# Altium project PIC18F57Q84_Curiosity_Nano.PrjPcb
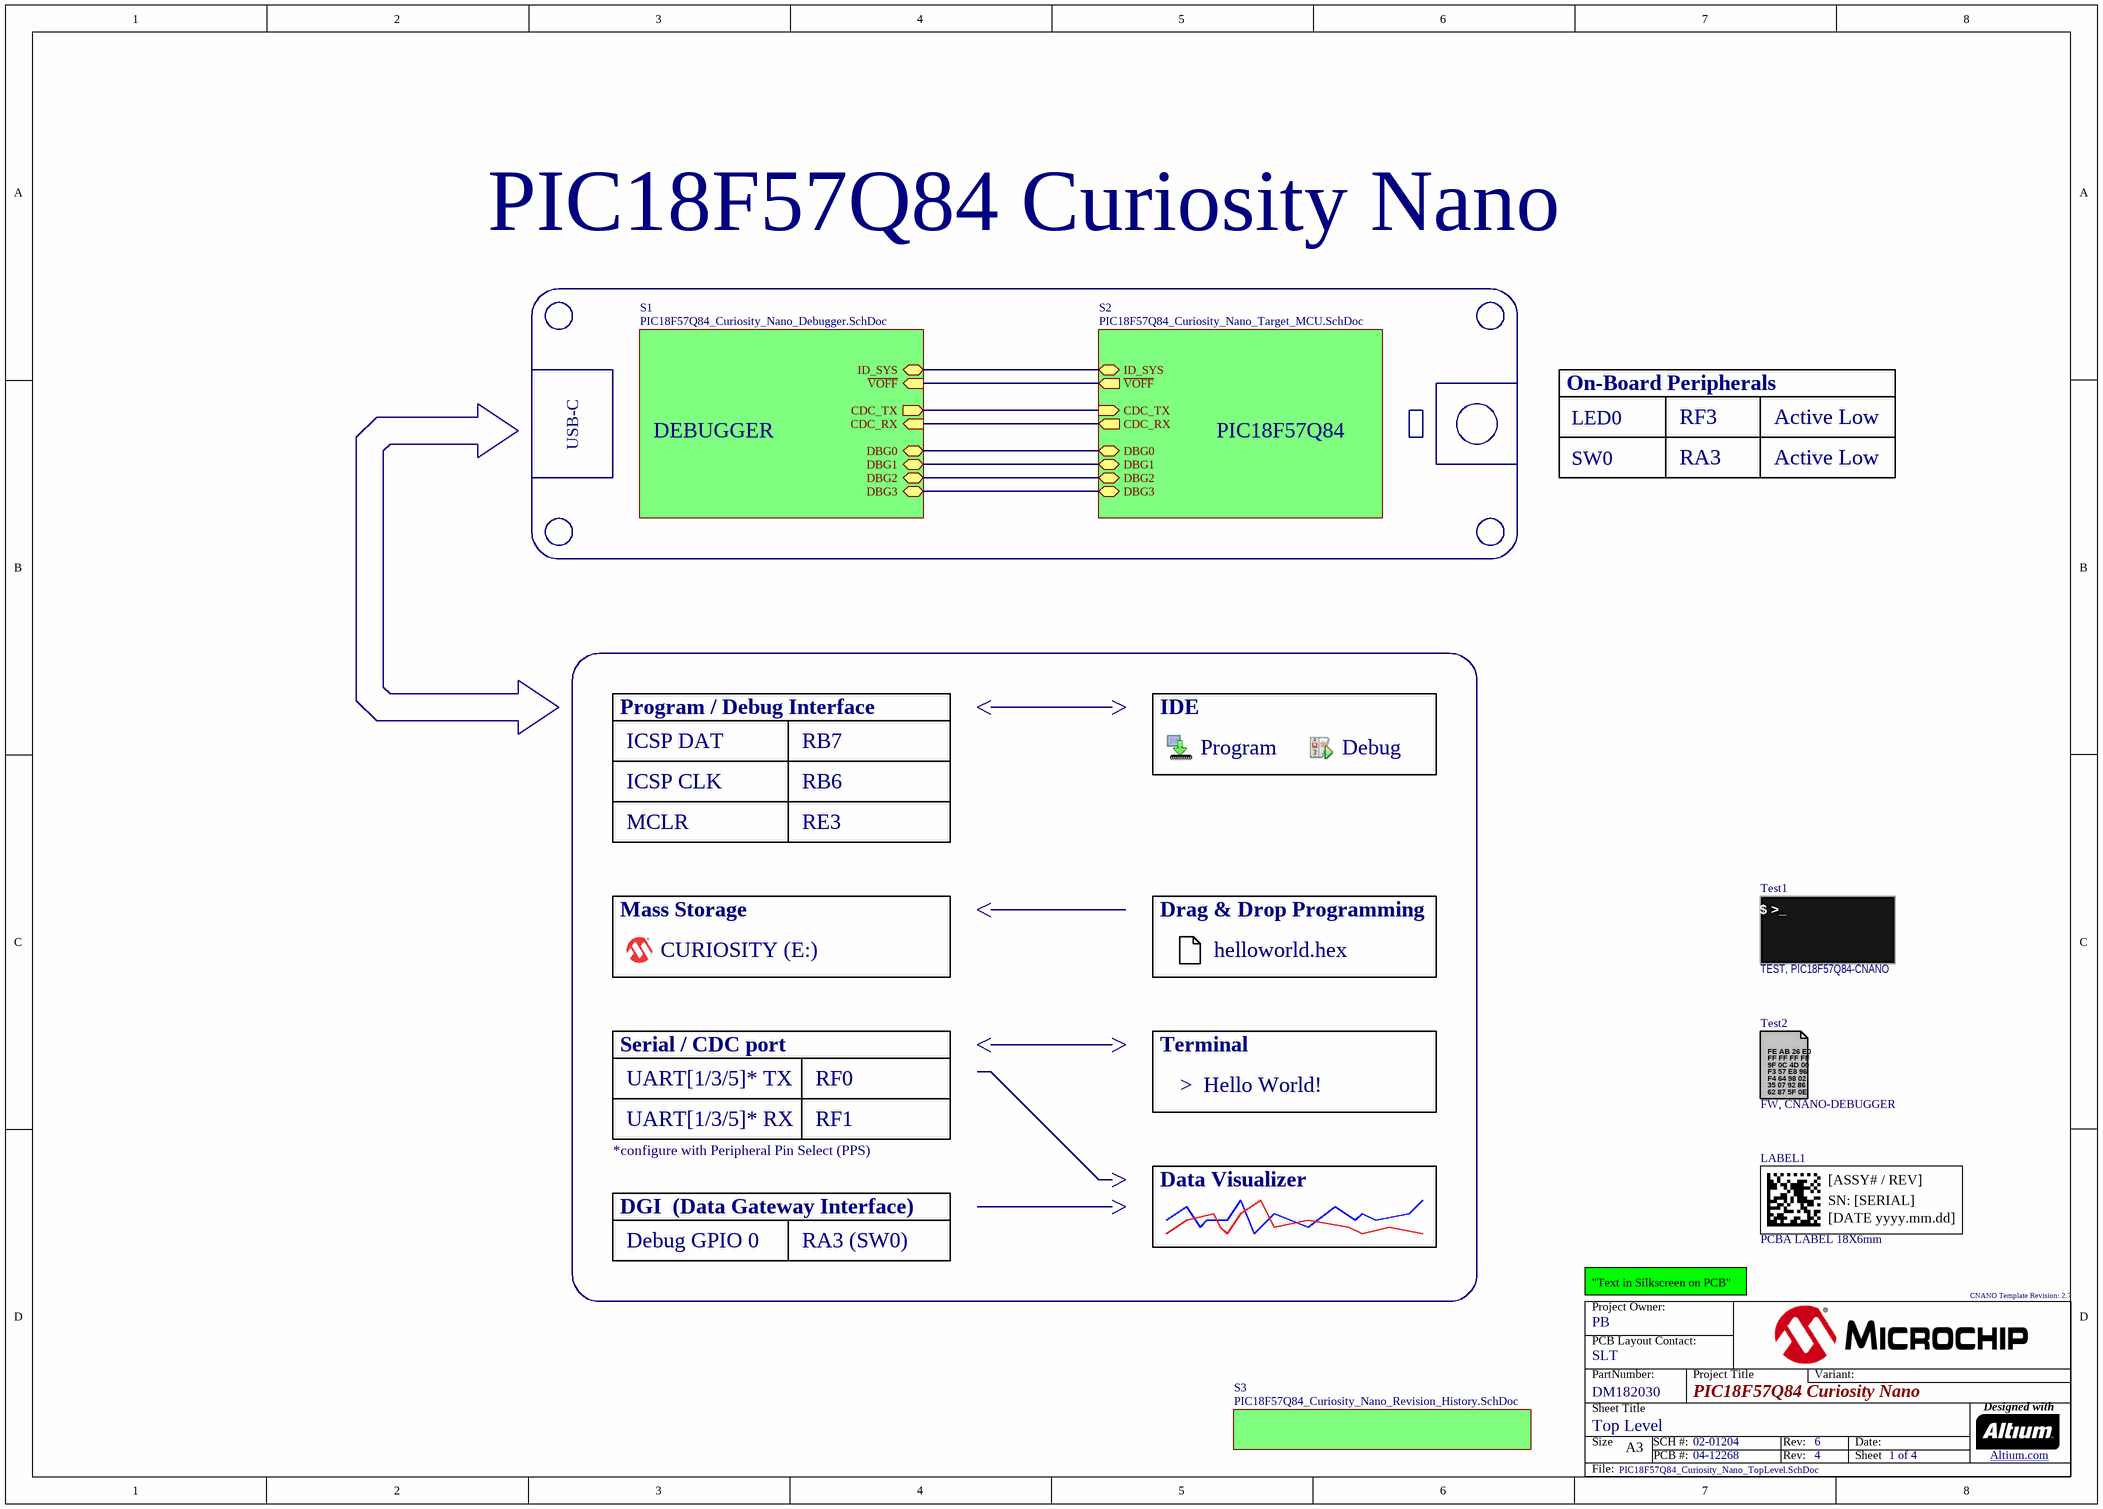
[diagram p0: PIC18F57Q84_Curiosity_Nano_TopLevel.SchDoc]
OutjobTitle: PIC18F57Q84-Curiosity-Nano; ProjectTitle: PIC18F57Q84 Curiosity Nano; ProjectTargetName: PIC18F57Q84; ProjectPCBFabRevision: 4; ProjectPCBFabNumber: 04-12268; ProjectPCBAssyRevision: 6; ProjectPCBAssyNumber: 02-01204; ProjectPartNumber: DM182030; ProjectContactPCB: SLT; ProjectContactOwner: PB; CNANO_Template_Revision: 2.7
4 sheets, 87 parts. Net scope: hierarchical (ports join the sheet entries above them; power ports are global).
Board file: PIC18F57Q84_Curiosity_Nano.PcbDoc
Sheets:
  PIC18F57Q84_Curiosity_Nano_TopLevel.SchDoc
    S2 = PIC18F57Q84_Curiosity_Nano_Target_MCU.SchDoc
    S1 = PIC18F57Q84_Curiosity_Nano_Debugger.SchDoc
    S3 = PIC18F57Q84_Curiosity_Nano_Revision_History.SchDoc

## Sheet PIC18F57Q84_Curiosity_Nano_TopLevel.SchDoc
size A3; SheetTitle: Top Level; CompanyName: Microchip Technology Inc.; Organization: Microchip Technology; Address1: 2355 West Chandler Blvd.; Address2: Chandler, AZ  85224; Address4: USA; SheetNumber: 1; SheetTotal: 4; Time: Time

### Parts
LABEL1  value PCBA LABEL 18X6mm  [08-10015]  (hidden comment: 08-10015)
Test1  Description_: TEST, PIC18F57Q84-CNANO  (hidden comment: Mechanical)  (mechanical)
Test2  Description_: FW, CNANO-DEBUGGER  (hidden comment: Mechanical)  (mechanical)

### Sub-sheets
S1 = PIC18F57Q84_Curiosity_Nano_Debugger.SchDoc: DBG2 (bidir), DBG1 (bidir), DBG3 (bidir), DBG0 (bidir), ~{VOFF} (in), ID_SYS (bidir), CDC_RX (in), CDC_TX (out)
S2 = PIC18F57Q84_Curiosity_Nano_Target_MCU.SchDoc: DBG0 (bidir), DBG1 (bidir), DBG3 (bidir), DBG2 (bidir), ~{VOFF} (out), ID_SYS (bidir), CDC_RX (out), CDC_TX (in)
S3 = PIC18F57Q84_Curiosity_Nano_Revision_History.SchDoc: no entries

### Nets
CDC_RX: sheet S2/CDC_RX, sheet S1/CDC_RX
CDC_TX: sheet S2/CDC_TX, sheet S1/CDC_TX
DBG0: sheet S2/DBG0, sheet S1/DBG0
DBG1: sheet S2/DBG1, sheet S1/DBG1
DBG2: sheet S2/DBG2, sheet S1/DBG2
DBG3: sheet S2/DBG3, sheet S1/DBG3
ID_SYS: sheet S2/ID_SYS, sheet S1/ID_SYS
~{VOFF}: sheet S2/~{VOFF}, sheet S1/~{VOFF}

### Notes on the sheet
- USB-C
- DEBUGGER
- On-Board Peripherals
- LED0
- RF3
- Active Low
- SW0
- RA3
- Program / Debug Interface
- IDE
- ICSP DAT
- RB7
- Program
- Debug
- ICSP CLK
- MCLR
- RB6
- RE3
- Mass Storage
- Drag & Drop Programming
- CURIOSITY (E:)
- helloworld.hex
- Serial / CDC port
- Terminal
- UART[1/3/5]* TX
- UART[1/3/5]* RX
- RF1
- RF0
- >  Hello World!
- *configure with Peripheral Pin Select (PPS)
- Data Visualizer
- DGI  (Data Gateway Interface)
- Debug GPIO 0
- RA3 (SW0)
- "Text in Silkscreen on PCB"
- Project Owner:
- PCB Layout Contact:
- PartNumber:
- Project Title
- Variant:
- Sheet Title
- Size
- A3
- SCH #:
- PCB #:
- Rev:
- Date:
- Sheet
- Designed with
- Altium.com <http://go.altium.com/MicrochipLandingPage_Evaluation.html>
- File:
- (in symbol 08-10015) [ASSY# / REV]; SN: [SERIAL]; [DATE yyyy.mm.dd]
- (in symbol 13-00018) FE AB 26 E0; FF FF FF FF; 9F 0C 4D 00; F3 57 E8 96; F4 64 98 02; 35 07 92 86; 62 87 5F 0E
- (in symbol 13-01146) $ >_

### Library data of the parts
LABEL1 = 08-10015: Manufacturer 1: ACT Logimark AS; Manufacturer Part Number 1: 505462; Description_: LABEL PCBA 18x6mm Datamatrix Assy# / Rev / Serial / Date; Populated: MECH; Revision: 4; Symbol: 08-10015; Category: MCHP-Manufacturing; Type: PCBA Label; Manufacturer 2: Sunrise Paper (M) Sdn Bhd; Manufacturer Part Number 2: 037268-5; Manufacturer 3: Raynen; Manufacturer Part Number 3: 10010407; Supplier 1: ACT Logimark AS; Supplier Part Number 1: 505462; Supplier 2: Microchip Technology; Supplier Part Number 2: 01000-004967; Supplier 3: Raynen; Supplier Part Number 3: 10010407
Test1 = 13-01146: Populated: Yes; Revision: 5; Type: Test Procedure Automated; Category: MCHP-Manufacturing
Test2 = 13-00018: Populated: Yes; Value: Debugger Firmware; Revision: 9; Type: Test Procedure Firmware; Category: MCHP-Manufacturing

## Sheet PIC18F57Q84_Curiosity_Nano_Target_MCU.SchDoc
size A3; SheetTitle: Target MCU; CompanyName: Microchip Technology Inc.; Organization: Microchip Technology; Address1: 2355 West Chandler Blvd.; Address2: Chandler, AZ  85224; Address4: USA; SheetNumber: 2; SheetTotal: 4; Time: Time
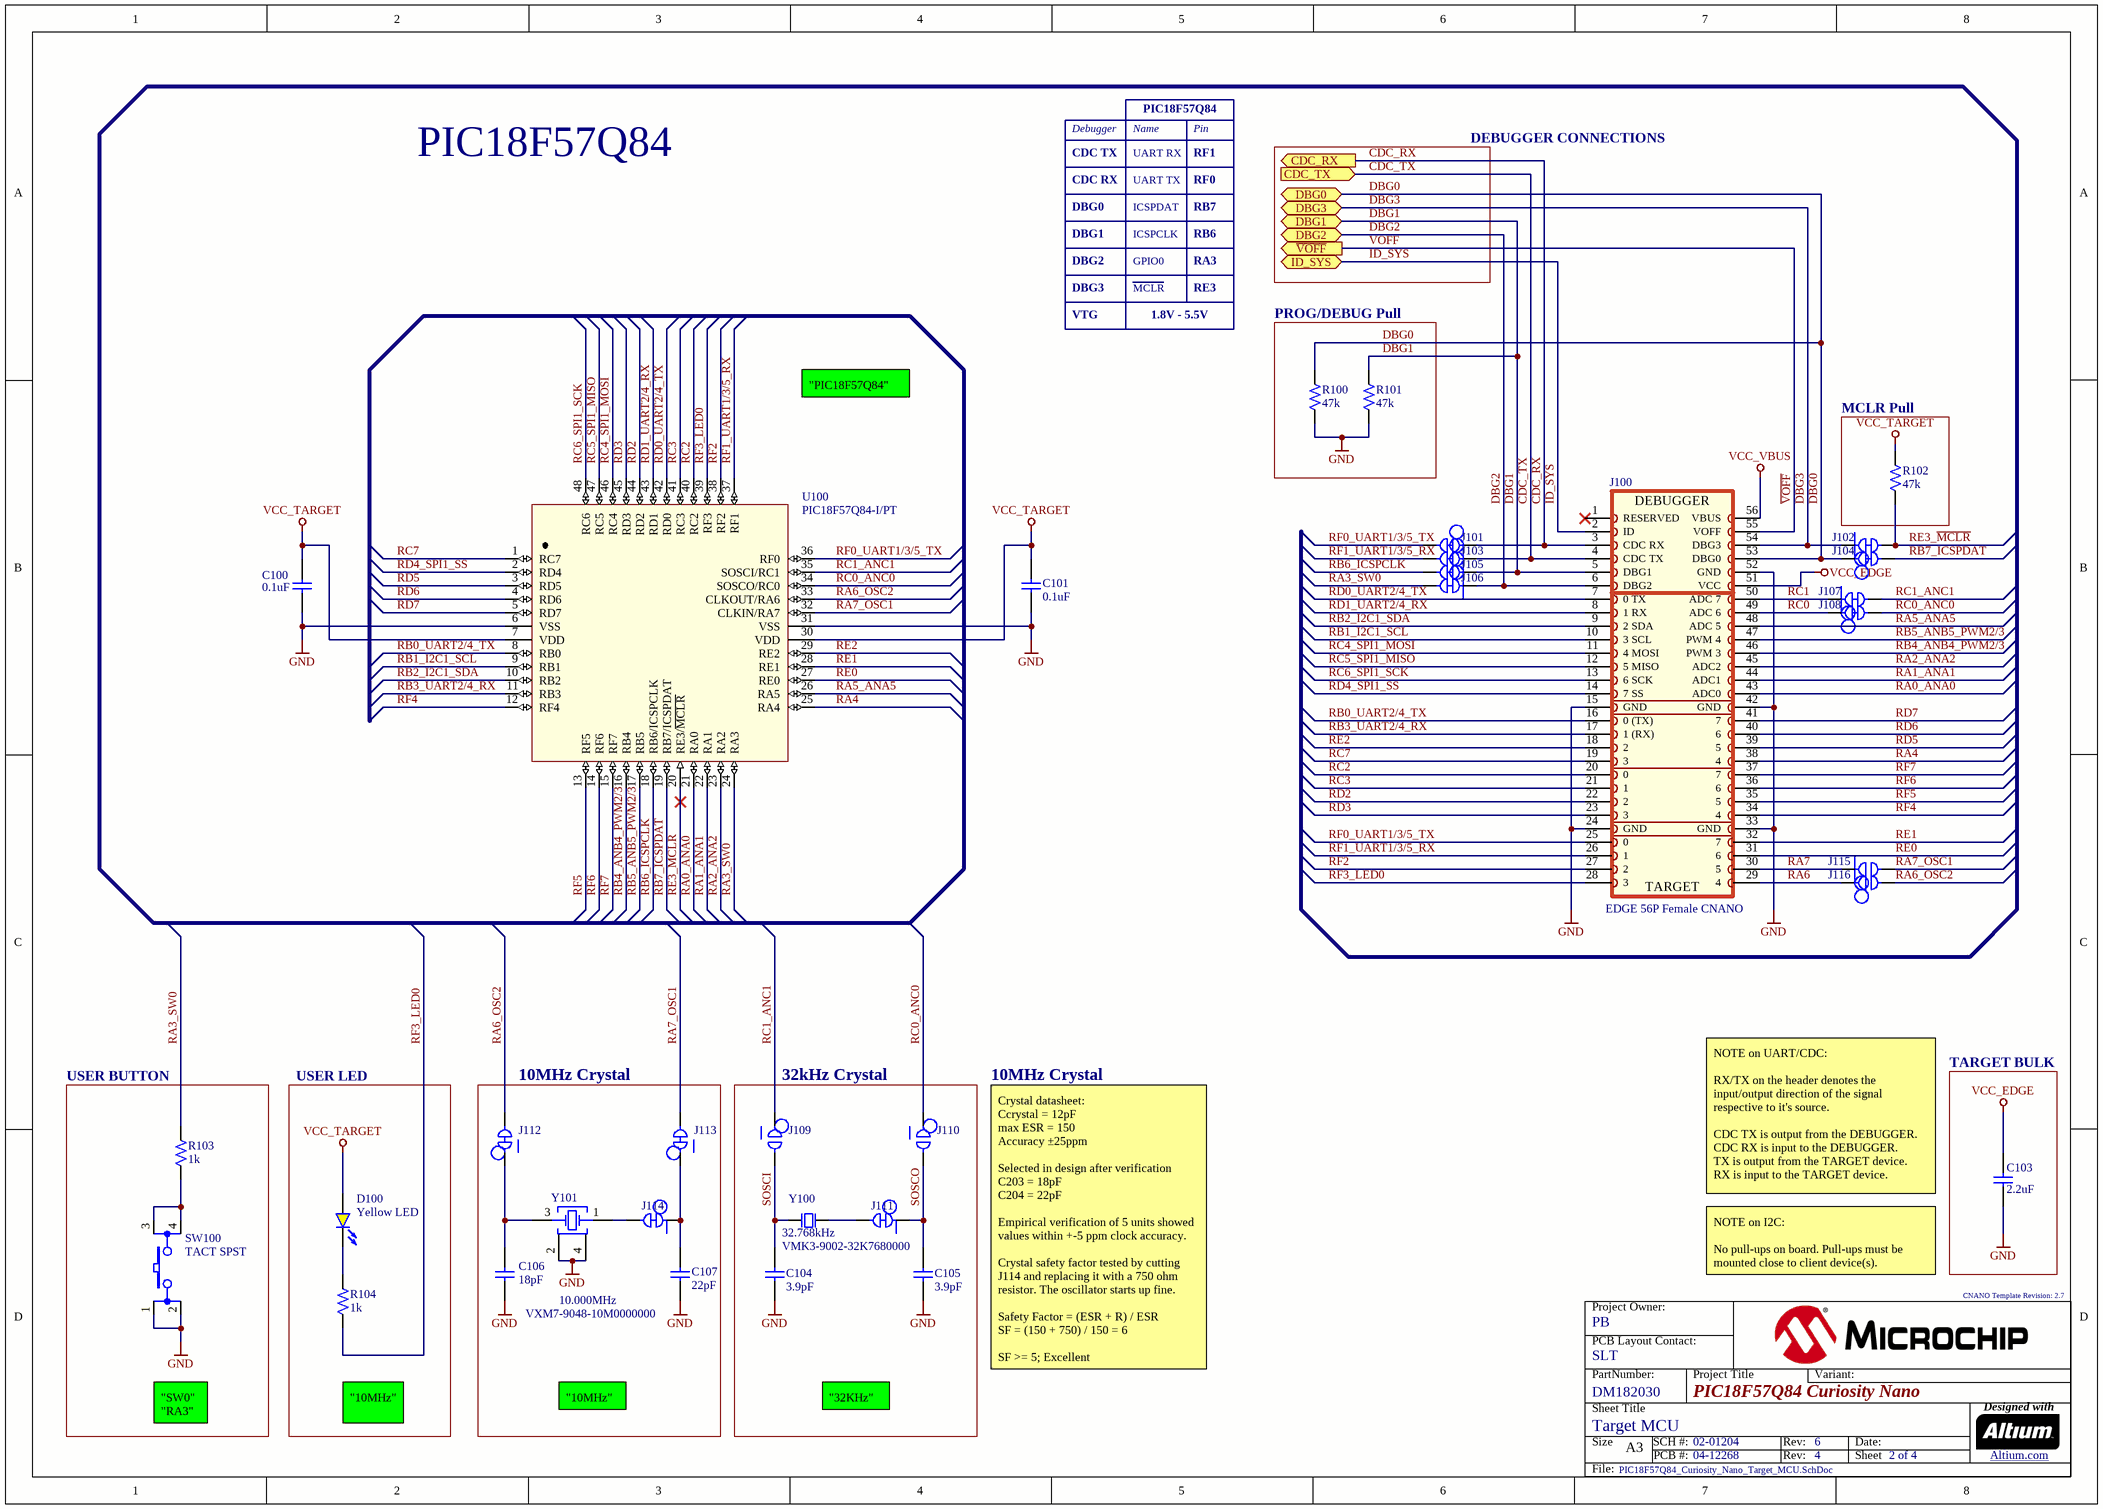
[diagram p1: PIC18F57Q84_Curiosity_Nano_Target_MCU.SchDoc]

### Parts
C100  value 0.1uF  [CAP_C_0402]  (hidden comment: Capacitor NP)
C101  value 0.1uF  [CAP_C_0402]  (hidden comment: Capacitor NP)
C103  value 2.2uF  [CAP_C_0402]  (hidden comment: Capacitor NP)
C104  value 3.9pF  [CAP_C_0402]  (hidden comment: Capacitor NP)
C105  value 3.9pF  [CAP_C_0402]  (hidden comment: Capacitor NP)
C106  value 18pF  [CAP_C_0402]  (hidden comment: Capacitor NP)
C107  value 22pF  [CAP_C_0402]  (hidden comment: Capacitor NP)
D100  value Yellow LED  [LED_0603_Yellow]  (hidden comment: LED_yellow)
J100  value EDGE 56P Female CNANO  [CON_EDGE_CNANO-56]  (hidden comment: CON EDGE CNANO-56)  (no BOM)
J101  CON JMPR LINK CLOSED  [CON_JMPR_0402_PCB_TRACE_LINK_0.9mm_PAD_0.6mm_PTH]  (value not drawn)  (net tie, no BOM)
J102  CON JMPR LINK CLOSED  [CON_JMPR_0402_PCB_TRACE_LINK_0.9mm_PAD_0.6mm_PTH]  (value not drawn)  (net tie, no BOM)
J103  CON JMPR LINK CLOSED  [CON_JMPR_0402_PCB_TRACE_LINK_0.9mm_PAD_0.6mm_PTH]  (value not drawn)  (net tie, no BOM)
J104  CON JMPR LINK CLOSED  [CON_JMPR_0402_PCB_TRACE_LINK_0.9mm_PAD_0.6mm_PTH]  (value not drawn)  (net tie, no BOM)
J105  CON JMPR LINK CLOSED  [CON_JMPR_0402_PCB_TRACE_LINK_0.9mm_PAD_0.6mm_PTH]  (value not drawn)  (net tie, no BOM)
J106  CON JMPR LINK CLOSED  [CON_JMPR_0402_PCB_TRACE_LINK_0.9mm_PAD_0.6mm_PTH]  (value not drawn)  (net tie, no BOM)
J107  CON JMPR LINK CLOSED  [CON_JMPR_0402_PCB_TRACE_LINK_0.9mm_PAD_0.6mm_PTH]  (value not drawn)  (net tie, no BOM)
J108  CON JMPR LINK CLOSED  [CON_JMPR_0402_PCB_TRACE_LINK_0.9mm_PAD_0.6mm_PTH]  (value not drawn)  (net tie, no BOM)
J109  CON JMPR SOLDER-STRAP OPEN SMD  [CON_JMPR_1mmX1mm_ROUND_SOLDER-STRAP]  (value not drawn)  (no BOM)
J110  CON JMPR SOLDER-STRAP OPEN SMD  [CON_JMPR_1mmX1mm_ROUND_SOLDER-STRAP]  (value not drawn)  (no BOM)
J111  CON JMPR LINK CLOSED  [CON_JMPR_0402_PCB_TRACE_LINK]  (value not drawn)  (net tie, no BOM)
J112  CON JMPR LINK CLOSED  [CON_JMPR_0402_PCB_TRACE_LINK_0.9mm_PAD_0.6mm_PTH]  (value not drawn)  (net tie, no BOM)
J113  CON JMPR LINK CLOSED  [CON_JMPR_0402_PCB_TRACE_LINK_0.9mm_PAD_0.6mm_PTH]  (value not drawn)  (net tie, no BOM)
J114  CON JMPR LINK CLOSED  [CON_JMPR_0402_PCB_TRACE_LINK]  (value not drawn)  (net tie, no BOM)
J115  CON JMPR SOLDER-STRAP OPEN SMD  [CON_JMPR_1mmX1mm_ROUND_SOLDER-STRAP]  (value not drawn)  (no BOM)
J116  CON JMPR SOLDER-STRAP OPEN SMD  [CON_JMPR_1mmX1mm_ROUND_SOLDER-STRAP]  (value not drawn)  (no BOM)
R100  value 47k  [RES_C_0402]  (hidden comment: Resistor)
R101  value 47k  [RES_C_0402]  (hidden comment: Resistor)
R102  value 47k  [RES_C_0402]  (hidden comment: Resistor)
R103  value 1k  [RES_C_0402]  (hidden comment: Resistor)
R104  value 1k  [RES_C_0402]  (hidden comment: Resistor)
SW100  value TACT SPST  [SW_TACT_SMD_DW_TS604VM1-035CR-R]  (hidden comment: Switch 4 Pin)
U100  value PIC18F57Q84-I/PT  [TQFP-48_7x7]  (hidden comment: PIC18F5xQ84 TQFP-48)
Y100  value 32.768kHz  Manufacturer Part Number 1: VMK3-9002-32K7680000  [CRYSTAL_VMK3_L3.2W1.5H0.9]  (hidden comment: Crystal 2 Pins)
Y101  value 10.000MHz  Manufacturer Part Number 1: VXM7-9048-10M0000000  [CRYSTAL_L3.2W2.5H0.8]  (hidden comment: Crystal 4 pins 1-3)

### Blocks framed on the sheet
PROG/DEBUG Pull: R100 R101
MCLR Pull: R102
USER BUTTON: R103 SW100
USER LED: D100 R104
10MHz Crystal: C106 C107 J112-J114 Y101
32kHz Crystal: C104 C105 J109-J111 Y100
TARGET BULK: C103

### Ports
CDC_RX (out), CDC_TX (in), DBG0 (bidir), DBG1 (bidir), DBG2 (bidir), DBG3 (bidir), ID_SYS (bidir), ~{VOFF} (out)

### Nets
GND: C100.2 C101.1 C103.1 C104.1 C105.2 C106.1 C107.1 J100.15(GND) J100.24(GND) J100.33(GND) J100.42(GND) J100.52(GND) R100.2 R101.2 SW100.1 SW100.2 U100.6(VSS) U100.31(VSS) Y101.2 Y101.4
VCC_EDGE: C103.2 J100.51(VCC)
VCC_TARGET: C100.1 C101.2 D100.1(A) R102.2 U100.7(VDD) U100.30(VDD)
VCC_VBUS: J100.56(VBUS)
CDC_RX: J100.3(CDC_RX) J101.1 ; port CDC_RX
CDC_TX: J100.4(CDC_TX) J103.1 ; port CDC_TX
DBG0: J100.53(DBG0) J104.1 R100.1 ; port DBG0
DBG1: J100.5(DBG1) J105.1 R101.1 ; port DBG1
DBG2: J100.6(DBG2) J106.1 ; port DBG2
DBG3: J100.54(DBG3) J102.1 ; port DBG3
ID_SYS: J100.2(ID) ; port ID_SYS
RA0_ANA0: J100.43(ADC0) U100.21(RA0)
RA1_ANA1: J100.44(ADC1) U100.22(RA1)
RA2_ANA2: J100.45(ADC2) U100.23(RA2)
RA3_SW0: J106.2 R103.1 U100.24(RA3)
RA4: J100.38(4) U100.25(RA4)
RA5_ANA5: J100.48(ADC_5) U100.26(RA5)
RA6: J100.29(4) J116.1
RA6_OSC2: J112.2 J116.2 U100.33(CLKOUT/RA6)
RA7: J100.30(5) J115.1
RA7_OSC1: J113.2 J115.2 U100.32(CLKIN/RA7)
RB0_UART2/4_TX: J100.16(0_(TX)) U100.8(RB0)
RB1_I2C1_SCL: J100.10(3_SCL) U100.9(RB1)
RB2_I2C1_SDA: J100.9(2_SDA) U100.10(RB2)
RB3_UART2/4_RX: J100.17(1_(RX)) U100.11(RB3)
RB4_ANB4_PWM2/3: J100.46(PWM_3) U100.16(RB4)
RB5_ANB5_PWM2/3: J100.47(PWM_4) U100.17(RB5)
RB6_ICSPCLK: J105.2 U100.18(RB6/ICSPCLK)
RB7_ICSPDAT: J104.2 U100.19(RB7/ICSPDAT)
RC0: J100.49(ADC_6) J108.1
RC0_ANC0: J108.2 J110.1 U100.34(SOSCO/RC0)
RC1: J100.50(ADC_7) J107.1
RC1_ANC1: J107.2 J109.1 U100.35(SOSCI/RC1)
RC2: J100.20(0) U100.40(RC2)
RC3: J100.21(1) U100.41(RC3)
RC4_SPI1_MOSI: J100.11(4_MOSI) U100.46(RC4)
RC5_SPI1_MISO: J100.12(5_MISO) U100.47(RC5)
RC6_SPI1_SCK: J100.13(6_SCK) U100.48(RC6)
RC7: J100.19(3) U100.1(RC7)
RD0_UART2/4_TX: J100.7(0_TX) U100.42(RD0)
RD1_UART2/4_RX: J100.8(1_RX) U100.43(RD1)
RD2: J100.22(2) U100.44(RD2)
RD3: J100.23(3) U100.45(RD3)
RD4_SPI1_SS: J100.14(7_SS) U100.2(RD4)
RD5: J100.39(5) U100.3(RD5)
RD6: J100.40(6) U100.4(RD6)
RD7: J100.41(7) U100.5(RD7)
RE0: J100.31(6) U100.27(RE0)
RE1: J100.32(7) U100.28(RE1)
RE2: J100.18(2) U100.29(RE2)
RE3_~{MCLR}: J102.2 R102.1 U100.20(RE3/~{MCLR})
RF0_UART1/3/5_TX: J100.25(0) J101.2 U100.36(RF0)
RF1_UART1/3/5_RX: J100.26(1) J103.2 U100.37(RF1)
RF2: J100.27(2) U100.38(RF2)
RF3_LED0: J100.28(3) R104.1 U100.39(RF3)
RF4: J100.34(4) U100.12(RF4)
RF5: J100.35(5) U100.13(RF5)
RF6: J100.36(6) U100.14(RF6)
RF7: J100.37(7) U100.15(RF7)
SOSCI: C104.2 J109.2 Y100.1(Osc1)
SOSCO: C105.1 J110.2 J111.1
~{VOFF}: J100.55(VOFF) ; port ~{VOFF}
NetC106_2: C106.2 J112.1 Y101.3
NetC107_2: C107.2 J113.1 J114.1
NetD100_2: D100.2(K) R104.2
NetJ111_2: J111.2 Y100.2(Osc2)
NetJ114_2: J114.2 Y101.1
NetR103_2: R103.2 SW100.3 SW100.4

Not connected (* = marked no-connect by the designer): J100 1(RESERVED)*

### Notes on the sheet
- PIC18F57Q84
- Debugger
- CDC TX
- CDC RX
- UART RX
- UART TX
- Name
- RF0
- RF1
- Pin
- DEBUGGER CONNECTIONS
- DBG0
- DBG1
- ICSPDAT
- ICSPCLK
- RB6
- RB7
- DBG2
- DBG3
- VTG
- GPIO0
- MCLR
- 1.8V - 5.5V
- RA3
- RE3
- "PIC18F57Q84"
- 10MHz Crystal
- NOTE on UART/CDC:
  RX/TX on the header denotes the input/output direction of the signal respective to it's source.
  CDC TX is output from the DEBUGGER.
  CDC RX is input to the DEBUGGER.
  TX is output from the TARGET device.
  RX is input to the TARGET device.
- NOTE on I2C:
  No pull-ups on board. Pull-ups must be mounted close to client device(s).
- Crystal datasheet:
  Ccrystal = 12pF
  max ESR = 150
  Accuracy ±25ppm
  Selected in design after verification
  C203 = 18pF
  C204 = 22pF
  Empirical verification of 5 units showed values within +-5 ppm clock accuracy.
  Crystal safety factor tested by cutting J114 and replacing it with a 750 ohm resistor. The oscillator starts up fine.
  Safety Factor = (ESR + R) / ESR
  SF = (150 + 750) / 150 = 6
  SF >= 5; Excellent
- "SW0"
  "RA3"
- "10MHz"
- "32KHz"
- Project Owner:
- PCB Layout Contact:
- PartNumber:
- Project Title
- Variant:
- Sheet Title
- Size
- A3
- SCH #:
- PCB #:
- Rev:
- Date:
- Sheet
- Designed with
- Altium.com <http://go.altium.com/MicrochipLandingPage_Evaluation.html>
- File:
- (in symbol CON2113) DEBUGGER; TARGET

### Library data of the parts
C100 C101 = CAP1033: Manufacturer 1: KEMET; Manufacturer Part Number 1: C0402C104K4RAC7867; Voltage: 16V; Description_: CAP CER 0.1uF 16V 10% X7R SMD 0402; Tolerance: 10%; Type: Ceramic; Populated: Yes; Temperature Coefficient: X7R; Restricted Sourcing: No; Package: 0402; Revision: 11; Symbol: Capacitor NP; Operating Temperature: -55C to +125C; Category: Capacitor; Manufacturer 2: Samsung Electro-Mechanics; Manufacturer Part Number 2: CL05B104KO5NNNC; Supplier 1: Digi-Key; Supplier Part Number 1: 399-C0402C104K4RAC7867TR-ND; Supplier 2: Digi-Key; Supplier Part Number 2: 1276-1001-1-ND; Manufacturer 3: Würth Elektronik; Manufacturer Part Number 3: 885012205037; Manufacturer 4: Samsung Electro-Mechanics; Manufacturer Part Number 4: CL05B104KO5NNND; Manufacturer 5: Samsung Electro-Mechanics; Manufacturer Part Number 5: CL05B104KO5NNNO; Manufacturer 6: Yageo; Manufacturer Part Number 6: CC0402KRX7R7BB104; Supplier 3: Digi-Key; Supplier Part Number 3: 732-7532-1-ND; Supplier 4: Mouser; Supplier Part Number 4: 187-CL05B104KO5NNND; Supplier 5: Samsung Electro-Mechanics; Supplier Part Number 5: CL05B104KO5NNNO; Supplier 6: Yageo; Supplier Part Number 6: CC0402KRX7R7BB104
C103 = CAP1208: Manufacturer 1: Murata; Manufacturer Part Number 1: GRM155R61A225KE95D; Voltage: 10V; Description_: CAP CER 2.2uF 10V 10% X5R SMD 0402; Tolerance: 10%; Type: Ceramic; Populated: YES; Temperature Coefficient: X5R; Restricted Sourcing: No; Package: 0402; Revision: 4; Symbol: Capacitor NP; Operating Temperature: -55C to +85C; Category: Capacitor; Supplier 1: Murata; Supplier Part Number 1: GRM155R61A225KE95D; Manufacturer 2: Samsung Electro-Mechanics; Manufacturer Part Number 2: CL05A225KP5NSNC; Supplier 2: Samsung Electro-Mechanics; Supplier Part Number 2: CL05A225KP5NSNC
C104 C105 = CAP2410: Manufacturer 1: KYOCERA AVX; Manufacturer Part Number 1: 04025A3R9CAT2A; Voltage: 50V; Description_: CAP CER 3.9pF 50V 0.25pF C0G SMD 0402; Tolerance: 0.25pF; Type: Ceramic; Populated: YES; Temperature Coefficient: C0G; Restricted Sourcing: No; Package: 0402; Revision: 2; Symbol: Capacitor NP; Operating Temperature: -55C to +125C; Category: Capacitor; Manufacturer 2: Kemet; Manufacturer Part Number 2: C0402C399C5GACTU; Supplier 1: Digi-Key; Supplier Part Number 1: 478-1065-1-ND; Supplier 2: Digi-Key; Supplier Part Number 2: 399-7793-1-ND
C106 = CAP1091: Manufacturer 1: Murata; Manufacturer Part Number 1: GCM1555C1H180JA16D; Voltage: 50V; Description_: CAP CER 18pF 50V 5% C0G SMD 0402; Tolerance: 5%; Temperature Coefficient: C0G; Type: Ceramic; Populated: YES; Restricted Sourcing: No; Package: 0402; Revision: 5; Symbol: Capacitor NP; Operating Temperature: -55C to +125C; Category: Capacitor; Manufacturer 2: Murata; Manufacturer Part Number 2: GRM1555C1H180JA01D; Manufacturer 3: Samsung Electro-Mechanics; Manufacturer Part Number 3: CL05C180JB5NNNC; Manufacturer 4: Yageo; Manufacturer Part Number 4: CC0402JRNPO9BN180; Manufacturer 5: Murata; Manufacturer Part Number 5: GRM1555C1H180JZ01; Supplier 1: Digi-Key; Supplier Part Number 1: 490-12650-2-ND; Supplier 2: Digi-Key; Supplier Part Number 2: 490-5858-1-ND; Supplier 3: Samsung Electro-Mechanics; Supplier Part Number 3: CL05C180JB5NNNC; Supplier 4: Yageo; Supplier Part Number 4: CC0402JRNPO9BN180; Supplier 5: Murata; Supplier Part Number 5: GRM1555C1H180JZ01
C107 = CAP1042: Manufacturer 1: Murata; Manufacturer Part Number 1: GRM1555C1H220JA01D; Voltage: 50V; Description_: CAP CER 22pF 50V 5% NP0 SMD 0402; Tolerance: 5%; Temperature Coefficient: NP0; Type: Ceramic; Populated: Yes; Restricted Sourcing: No; Package: 0402; Revision: 4; Symbol: Capacitor NP; Operating Temperature: -55C to +125C; Category: Capacitor; Supplier 1: Digi-Key; Supplier Part Number 1: 490-5868-2-ND
D100 = DIODE1547: LED; Manufacturer 1: Rohm Semiconductor; Manufacturer Part Number 1: SML-D12Y1WT86; Description_: LED YELLOW DIFFUSED 1608 SMD; Type: LED Single; Forward Current: 20mA; Populated: YES; Restricted Sourcing: No; Revision: 1; Symbol: LED_yellow; Package: 0603; Category: Diode; Supplier 1: Digi-Key; Supplier Part Number 1: SML-D12Y1WT86CT-ND
J100 = CON2113: Description_: CON EDGE CURIOSITY-NANO 2.54 56P Female PCB TH; Populated: MECH; Restricted Sourcing: No; Revision: 1; Symbol: CON EDGE CNANO-56; Type: Edge Card; Category: Connector; Assembly Type: SMD
J101-J108 J112 J113 = CON2115: Value: CON JMPR LINK CLOSED_0.9mm TH PAD; Description_: CON JUMPER 0402 CLOSED PCB TRACE LINK MANUAL CUT WITH 0.9mm TH PADS; Populated: DNP; Restricted Sourcing: No; Revision: 1; Symbol: CON JMPR LINK CLOSED; Type: Test Point; Category: Connector; Assembly Type: Mechanical
J109 J110 J115 J116 = CON2117: Value: CON JMPR SODER-STRAP OPEN; Description_: CON JUMPER SOLDER-STRAP OPEN 1mm X 1mm ROUND SMD; Populated: DNP; Restricted Sourcing: No; Revision: 1; Symbol: CON JMPR SOLDER-STRAP OPEN SMD; Type: Test Point; Category: Connector; Assembly Type: SMD
J111 J114 = CON2116: Value: CON 0402 PCB TRACE LINK; Description_: CON JUMPER 0402 CLOSED PCB TRACE LINK MANUAL CUT; Populated: DNP; Restricted Sourcing: No; Revision: 1; Symbol: CON JMPR LINK CLOSED; Category: Connector; Assembly Type: Mechanical
R100-R102 = RES2662: Manufacturer 1: Yageo; Manufacturer Part Number 1: RC0402FR-0747KL; Tolerance: 1%; Description_: RES TKF 47k 1% 1/16W SMD 0402; Voltage: 50V; Populated: YES; Restricted Sourcing: No; Package: 0402; Revision: 3; Symbol: Resistor; Category: Resistor; Type: RES SMD; Composition: TKF; Supplier 1: Digi-Key; Supplier Part Number 1: 311-47.0KLRCT-ND
R103 R104 = RES1022: Manufacturer 1: Panasonic; Manufacturer Part Number 1: ERJ-2RKF1001X; Tolerance: 1%; Description_: RES TKF 1k 1% 1/10W SMD 0402; Voltage: 50V; Power: 1/10W; Populated: YES; Temperature Coefficient: 100ppm/C; Package: 0402; Revision: 3; Symbol: Resistor; Operating Temperature: -55C to +155C; Category: Resistor; Type: RES SMD; Composition: TKF; Supplier 1: Digi-Key; Supplier Part Number 1: P1.00KLTR-ND
SW100 = SWITCH1172: Switch; Manufacturer 1: Dailywell Electronics Co.,Ltd.; Manufacturer Part Number 1: TS604VM1-035CR-R; Description_: SWITCH TACT SPST 12 50mA TS604VM1-035CR-R SMD; Voltage: 12V; Current: 50mA; Populated: YES; Restricted Sourcing: No; Revision: 2; Symbol: Switch 4 Pin; Operating Temperature: -40C to +85C; Category: Switch; Supplier 1: Cabcon A/S; Supplier Part Number 1: TS604VM1-035CR-R; Type: Tactile
U100 = MIC8901: Manufacturer 1: Microchip Technology; Manufacturer Part Number 1: PIC18F57Q84T-I/PT; Description_: MCHP MCU 8-BIT 64MHz 128kB 8kB PIC18F57Q84-I/PT TQFP-48; Populated: YES; Restricted Sourcing: No; Symbol: PIC18F5xQ84 TQFP-48; Type: 8-Bit; Revision: 2; Category: MCHP-Microcontroller; Manufacturer 2: Microchip Technology; Manufacturer Part Number 2: PIC18F57Q84-I/PT; Supplier 1: Microchip Technology; Supplier Part Number 1: PIC18F57Q84T-I/PT; Supplier 2: Microchip Technology; Supplier Part Number 2: PIC18F57Q84-I/PT; Operating Temperature: -40C to +85C
Y100 = MIC9479: Crystal; Manufacturer 1: Microchip Technology; Description_: MCHP CRYSTAL 32.768kHz 7pF VMK3-9002-32K7680000 SMD L3.2W1.5H0.9; Populated: YES; Restricted Sourcing: No; Revision: 2; Symbol: Crystal 2 Pins; Category: MCHP-Clock/Timing; Type: Crystal; Supplier 1: Microchip Technology; Supplier Part Number 1: VMK3-9002-32K7680000; Manufacturer 2: Microchip Technology; Manufacturer Part Number 2: VMK3-9002-32K7680000TR; Supplier 2: Microchip Technology; Supplier Part Number 2: VMK3-9002-32K7680000TR; Operating Temperature: -40C to +85C
Y101 = IC2551: Crystal; Manufacturer 1: Microchip Technology; Description_: MCHP CRYSTAL 10.000MHz 12pF VXM7-9048-10M0000000 SMD L3.2W2.5H0.8; Populated: YES; Restricted Sourcing: No; Revision: 1; Symbol: Crystal 4 pins 1-3; Category: MCHP-Clock/Timing; Type: Crystal; Manufacturer 2: Microchip Technology; Manufacturer Part Number 2: VXM7-9048-10M0000000TR; Supplier 1: Microchip Technology; Supplier Part Number 1: VXM7-9048-10M0000000; Supplier 2: Microchip Technology; Supplier Part Number 2: VXM7-9048-10M0000000TR; Operating Temperature: -40C to +85C

## Sheet PIC18F57Q84_Curiosity_Nano_Debugger.SchDoc
size A3; SheetTitle: Debugger; CompanyName: Microchip Technology Inc.; Organization: Microchip Technology; Address1: 2355 West Chandler Blvd.; Address2: Chandler, AZ  85224; Address4: USA; SheetNumber: 3; SheetTotal: 4; Time: Time
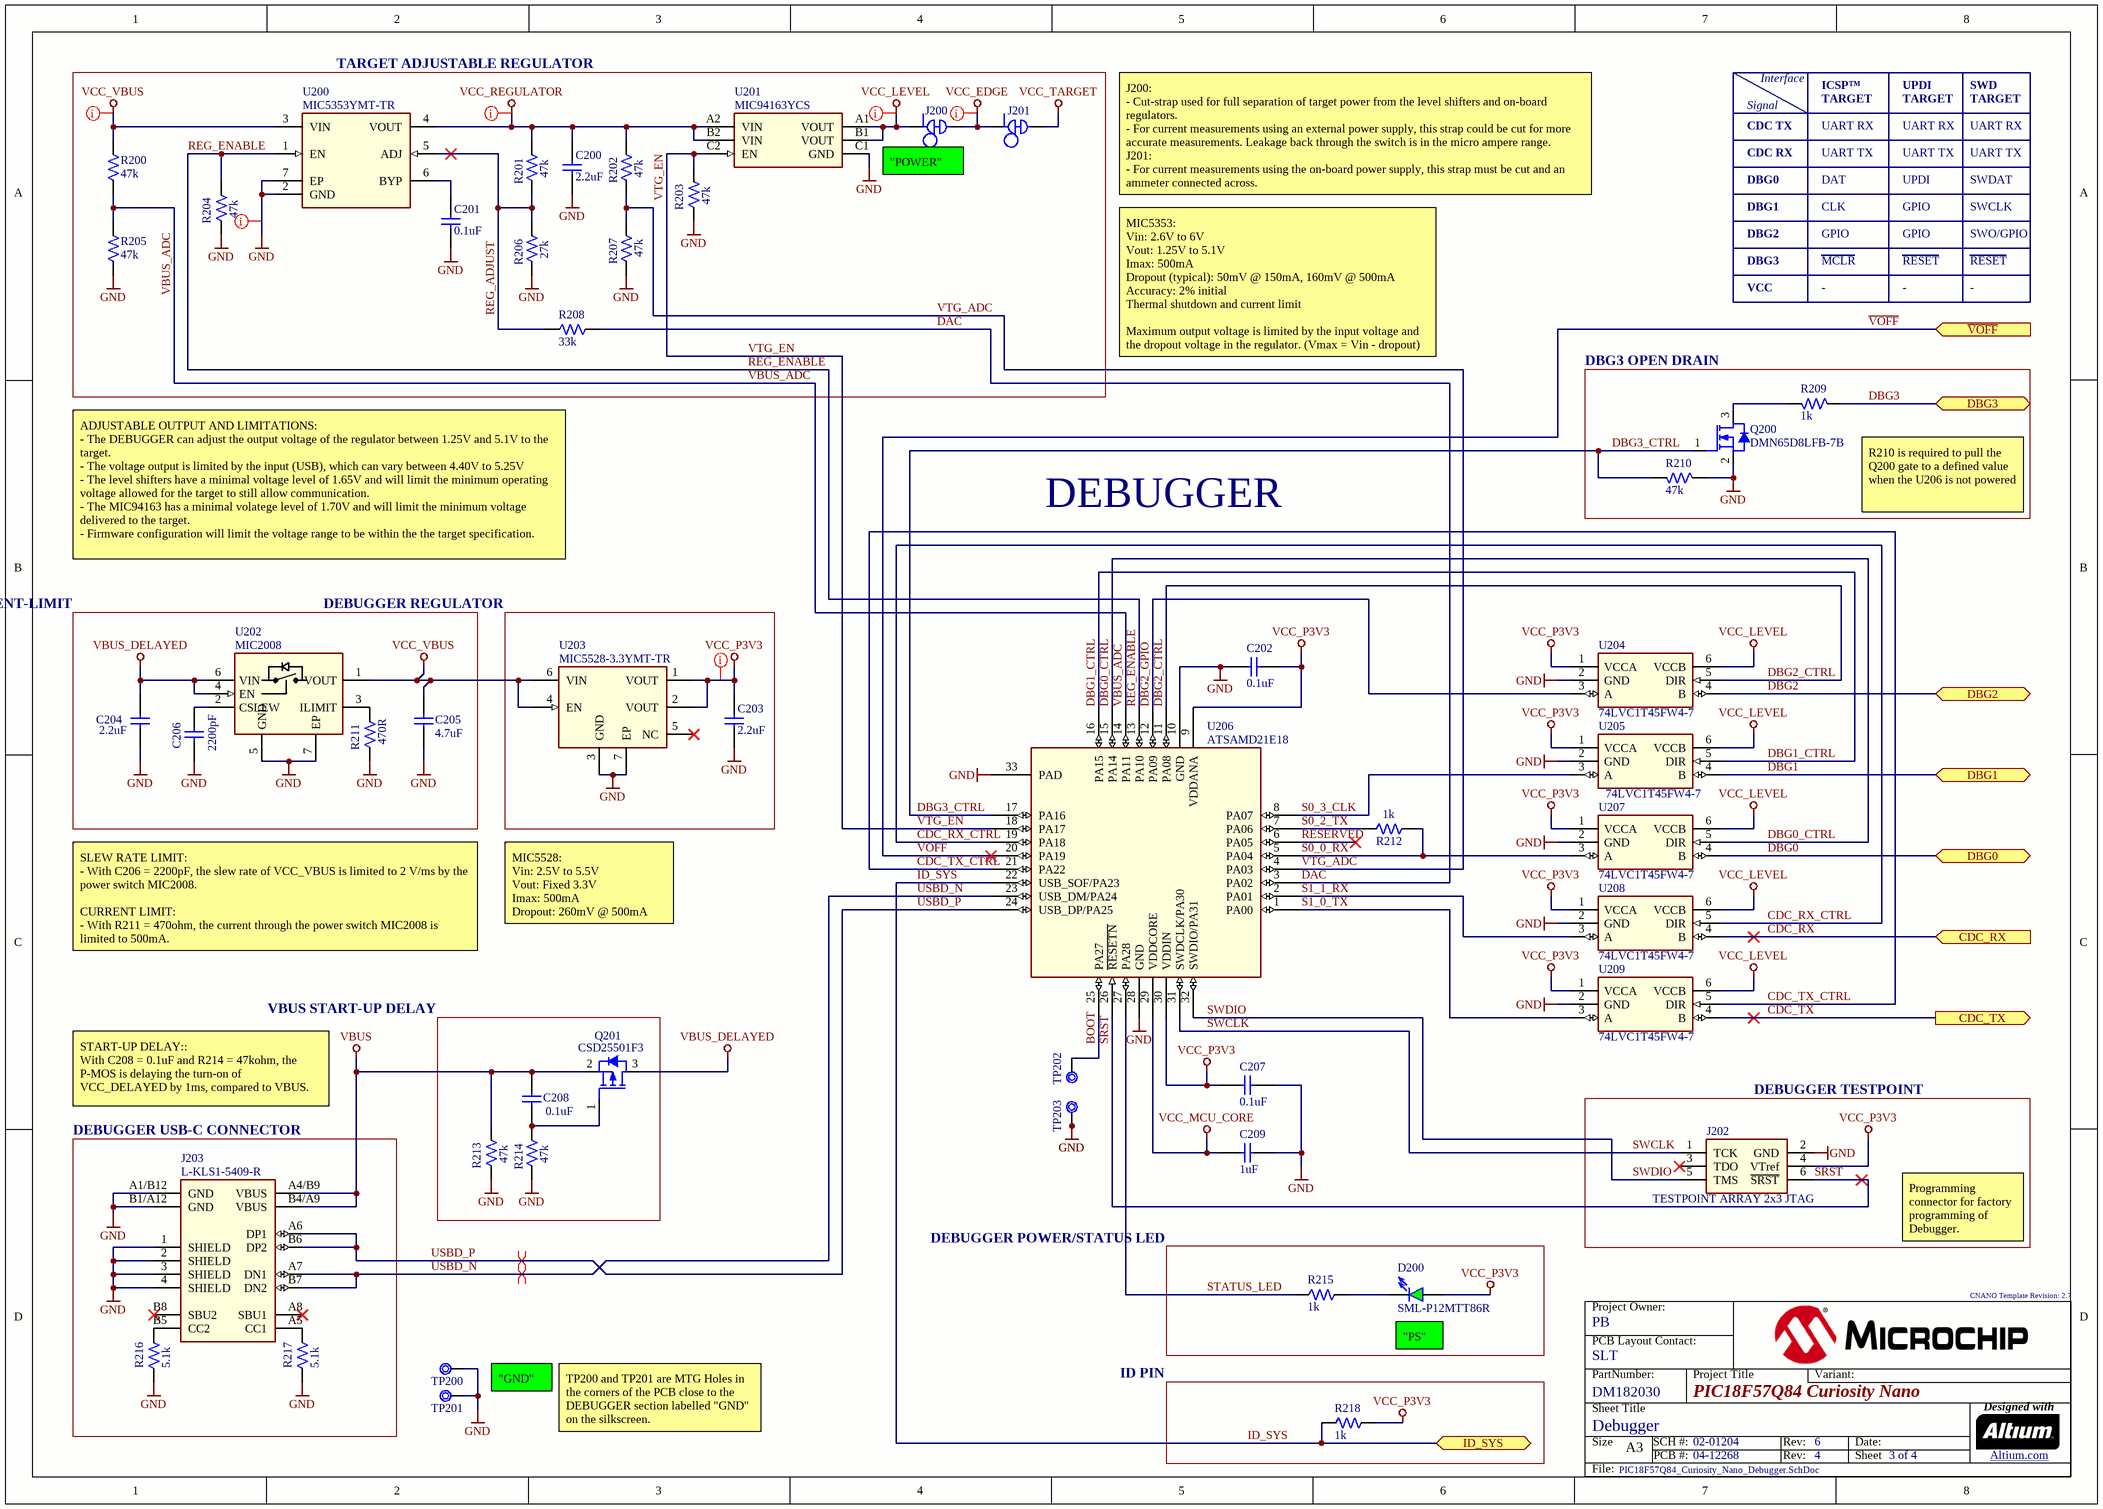
[diagram p2: PIC18F57Q84_Curiosity_Nano_Debugger.SchDoc]

### Parts
C200  value 2.2uF  [CAP_C_0402]  (hidden comment: Capacitor NP)
C201  value 0.1uF  [CAP_C_0402]  (hidden comment: Capacitor NP)
C202  value 0.1uF  [CAP_C_0402]  (hidden comment: Capacitor NP)
C203  value 2.2uF  [CAP_C_0402]  (hidden comment: Capacitor NP)
C204  value 2.2uF  [CAP_C_0402]  (hidden comment: Capacitor NP)
C205  value 4.7uF  [CAP_C_0603]  (hidden comment: Capacitor NP)
C206  value 2200pF  [CAP_C_0402]  (hidden comment: Capacitor NP)
C207  value 0.1uF  [CAP_C_0402]  (hidden comment: Capacitor NP)
C208  value 0.1uF  [CAP_C_0402]  (hidden comment: Capacitor NP)
C209  value 1uF  [CAP_C_0402]  (hidden comment: Capacitor NP)
D200  Manufacturer Part Number 1: SML-P12MTT86R  [LED_0402_GREEN]  (hidden comment: LED_green)
J200  CON JMPR LINK CLOSED  [CON_JMPR_0402_PCB_TRACE_LINK]  (value not drawn)  (net tie, no BOM)
J201  CON JMPR LINK CLOSED  [CON_JMPR_2.54_1x2_TH_PCB_TRACE_LINK]  (value not drawn)  (net tie, no BOM)
J202  value TESTPOINT ARRAY 2x3 JTAG  [TESTPOINT_ARRAY_2x3_1.27mm_pitch_SMD]  (hidden comment: TP ARRAY NO BOM)  (no BOM)
J203  Manufacturer Part Number 1: L-KLS1-5409-R  [CON_USB2.0-C_RCPT_SMD_RA_KLS_KLS1-5409]  (hidden comment: CON USB2.0-C RCPT SMD RA KLS KLS1-5409)
Q200  value DMN65D8LFB-7B  [X1-DFN1006-3]  (hidden comment: Transistor MOS-N GSD)
Q201  value CSD25501F3  [LGA-3_GSD_0.7x0.6_CSD25501F3]  (hidden comment: Transistor MOS-P GSD)
R200  value 47k  [RES_C_0402]  (hidden comment: Resistor)
R201  value 47k  [RES_C_0402]  (hidden comment: Resistor)
R202  value 47k  [RES_C_0402]  (hidden comment: Resistor)
R203  value 47k  [RES_C_0402]  (hidden comment: Resistor)
R204  value 47k  [RES_C_0402]  (hidden comment: Resistor)
R205  value 47k  [RES_C_0402]  (hidden comment: Resistor)
R206  value 27k  [RES_C_0402]  (hidden comment: Resistor)
R207  value 47k  [RES_C_0402]  (hidden comment: Resistor)
R208  value 33k  [RES_C_0402]  (hidden comment: Resistor)
R209  value 1k  [RES_C_0402]  (hidden comment: Resistor)
R210  value 47k  [RES_C_0402]  (hidden comment: Resistor)
R211  value 470R  [RES_C_0402]  (hidden comment: Resistor)
R212  value 1k  [RES_C_0402]  (hidden comment: Resistor)
R213  value 47k  [RES_C_0402]  (hidden comment: Resistor)
R214  value 47k  [RES_C_0402]  (hidden comment: Resistor)
R215  value 1k  [RES_C_0402]  (hidden comment: Resistor)
R216  value 5.1k  [RES_C_0402]  (hidden comment: Resistor)
R217  value 5.1k  [RES_C_0402]  (hidden comment: Resistor)
R218  value 1k  [RES_C_0402]  (hidden comment: Resistor)
TP200  Test Point No BOM  [TP_3.6X2.7]  (value not drawn)  (no BOM)
TP201  Test Point No BOM  [TP_3.6X2.7]  (value not drawn)  (no BOM)
TP202  Test Point No BOM  [CON_TP_0.8dia_SMD_with_Test_Jig_Layer]  (value not drawn)  (no BOM)
TP203  Test Point No BOM  [CON_TP_0.8dia_SMD_with_Test_Jig_Layer]  (value not drawn)  (no BOM)
U200  value MIC5353YMT-TR  [MLF-6 1.6X1.6mm]  (hidden comment: MIC53XX ADJ MLF-6)
U201  value MIC94163YCS  [MIC94163_1.5MM_1MM]  (hidden comment: MIC94163_1.5MM_1MM)
U202  value MIC2008  [VDFN-6_2x2_EP0.8X1.40]  (hidden comment: MIC2008YML-TR VDFN-6)
U203  Manufacturer Part Number 1: MIC5528-3.3YMT-TR  [DFN-6_1.2x1.2]  (hidden comment: MIC5528MT DFN-6)
U204  value 74LVC1T45FW4-7  [X2-DFN1010-6]  (hidden comment: 74LVC(H)1T45 SOT-23-6_SC-70-6_SOT-6_SOT-363_DSBGA)
U205  value 74LVC1T45FW4-7  [X2-DFN1010-6]  (hidden comment: 74LVC(H)1T45 SOT-23-6_SC-70-6_SOT-6_SOT-363_DSBGA)
U206  value ATSAMD21E18  [QFN-32_5X5_EP3.6x3.6_L]  (hidden comment: SAMD21E QFN-32)
U207  value 74LVC1T45FW4-7  [X2-DFN1010-6]  (hidden comment: 74LVC(H)1T45 SOT-23-6_SC-70-6_SOT-6_SOT-363_DSBGA)
U208  value 74LVC1T45FW4-7  [X2-DFN1010-6]  (hidden comment: 74LVC(H)1T45 SOT-23-6_SC-70-6_SOT-6_SOT-363_DSBGA)
U209  value 74LVC1T45FW4-7  [X2-DFN1010-6]  (hidden comment: 74LVC(H)1T45 SOT-23-6_SC-70-6_SOT-6_SOT-363_DSBGA)

### Blocks framed on the sheet
TARGET ADJUSTABLE REGULATOR: C200 C201 J200 J201 R200-R208 U200 U201
DBG3 OPEN DRAIN: Q200 R209 R210
VBUS SLEW RATE- & CURRENT-LIMIT: C204-C206 R211 U202
DEBUGGER REGULATOR: C203 U203
VBUS START-UP DELAY: C208 Q201 R213 R214
DEBUGGER TESTPOINT: J202
DEBUGGER USB-C CONNECTOR: J203 R216 R217
DEBUGGER POWER/STATUS LED: D200 R215
ID PIN: R218

### Ports
CDC_RX (in), CDC_TX (out), DBG0 (bidir), DBG1 (bidir), DBG2 (bidir), DBG3 (bidir), ID_SYS (bidir), ~{VOFF} (in)

### Nets
GND: C200.1 C201.2 C202.1 C203.1 C204.1 C205.1 C206.1 C207.2 C209.1 J202.2(GND) J203.1(SHIELD) J203.2(SHIELD) J203.3(SHIELD) J203.4(SHIELD) J203.A1/B12(GND) J203.B1/A12(GND) Q200.2(S) R203.2 R204.2 R205.1 R206.1 R207.1 R210.2 R211.2 R213.2 R214.2 R216.2 R217.2 TP200.1 TP201.1 TP203.1 U200.2(GND) U200.7(EP) U201.C1(GND) U202.5(GND) U202.7(EP) U203.3(GND) U203.7(EP) U204.2(GND) U205.2(GND) U206.10(GND) U206.28(GND) U206.33(PAD) U207.2(GND) U208.2(GND) U209.2(GND)
VBUS: C208.2 J203.A4/B9(VBUS) J203.B4/A9(VBUS) Q201.2(S) R213.1
VBUS_DELAYED: C204.2 Q201.3(D) U202.4(EN) U202.6(VIN)
VCC_EDGE: J200.2 J201.1
VCC_LEVEL: J200.1 U201.A1(VOUT) U201.B1(VOUT) U204.6(VCCB) U205.6(VCCB) U207.6(VCCB) U208.6(VCCB) U209.6(VCCB)
VCC_MCU_CORE: C209.2 U206.29(VDDCORE)
VCC_P3V3: C202.2 C203.2 C207.1 D200.1(A) J202.4(VTref) R218.2 U203.1(VOUT) U203.2(VOUT) U204.1(VCCA) U205.1(VCCA) U206.9(VDDANA) U206.30(VDDIN) U207.1(VCCA) U208.1(VCCA) U209.1(VCCA)
VCC_REGULATOR: C200.2 R201.1 R202.2 U200.4(VOUT) U201.A2(VIN) U201.B2(VIN)
VCC_TARGET: J201.2
VCC_VBUS: C205.2 R200.1 U200.3(VIN) U202.1(VOUT) U203.4(EN) U203.6(VIN)
BOOT: TP202.1 U206.25(PA27)
CDC_RX: U208.4(B) ; port CDC_RX
CDC_RX_CTRL: U206.19(PA18) U208.5(DIR)
CDC_TX: U209.4(B) ; port CDC_TX
CDC_TX_CTRL: U206.21(PA22) U209.5(DIR)
DAC: R208.2 U206.3(PA02)
DBG0: U207.4(B) ; port DBG0
DBG0_CTRL: U206.15(PA14) U207.5(DIR)
DBG1: U205.4(B) ; port DBG1
DBG1_CTRL: U205.5(DIR) U206.16(PA15)
DBG2: U204.4(B) ; port DBG2
DBG2_CTRL: U204.5(DIR) U206.11(PA08)
DBG2_GPIO: U204.3(A) U206.12(PA09)
DBG3: R209.2 ; port DBG3
DBG3_CTRL: Q200.1(G) R210.1 U206.17(PA16)
ID_SYS: R218.1 U206.22(USB_SOF/PA23) ; port ID_SYS
REG_ADJUST: R201.2 R206.2 R208.1 U200.5(ADJ)
REG_ENABLE: R204.1 U200.1(EN) U206.13(PA10)
RESERVED: U206.6(PA05)
S0_0_RX: R212.1 U206.5(PA04) U207.3(A)
S0_2_TX: R212.2 U206.7(PA06)
S0_3_CLK: U205.3(A) U206.8(PA07)
S1_0_TX: U206.1(PA00) U209.3(A)
S1_1_RX: U206.2(PA01) U208.3(A)
~{SRST}: J202.6(~{SRST}) U206.26(~{RESETN})
STATUS_LED: R215.2 U206.27(PA28)
SWCLK: J202.1(TCK) U206.31(SWDCLK/PA30)
SWDIO: J202.5(TMS) U206.32(SWDIO/PA31)
USBD_N: J203.A7(DN1) J203.B7(DN2) U206.23(USB_DM/PA24)
USBD_P: J203.A6(DP1) J203.B6(DP2) U206.24(USB_DP/PA25)
~{VOFF}: U206.20(PA19) ; port ~{VOFF}
VBUS_ADC: R200.2 R205.2 U206.14(PA11)
VTG_ADC: R202.1 R207.2 U206.4(PA03)
VTG_EN: R203.1 U201.C2(EN) U206.18(PA17)
NetC201_1: C201.1 U200.6(BYP)
NetC206_2: C206.2 U202.2(CSLEW)
NetC208_1: C208.1 Q201.1(G) R214.1
NetD200_2: D200.2(K) R215.1
NetJ203_A5: J203.A5(CC1) R217.1
NetJ203_B5: J203.B5(CC2) R216.1
NetQ200_3: Q200.3(D) R209.1
NetR211_1: R211.1 U202.3(ILIMIT)

Not connected (* = marked no-connect by the designer): J202 3(TDO)*; J203 A8(SBU1)* B8(SBU2)*; U203 5(NC)*

### Layout directives
net class Power: GND, VCC_EDGE, VCC_LEVEL, VCC_P3V3, VCC_REGULATOR, VCC_VBUS
differential pair: USBD_N, USBD_P

### Notes on the sheet
- Signal
- Interface
- ICSP™
- TARGET
- UPDI
- SWD
- (near J200) "POWER"
- CDC TX
- CDC RX
- DBG0
- UART RX
- UART TX
- DAT
- SWDAT
- J200:
  - Cut-strap used for full separation of target power from the level shifters and on-board regulators.
  - For current measurements using an external power supply, this strap could be cut for more accurate measurements. Leakage back through the switch is in the micro ampere range.
  J201:
  - For current measurements using the on-board power supply, this strap must be cut and an ammeter connected across.
- DBG1
- DBG2
- CLK
- GPIO
- SWCLK
- SWO/GPIO
- DBG3
- VCC
- MCLR
- -
- RESET
- MIC5353:
  Vin: 2.6V to 6V
  Vout: 1.25V to 5.1V
  Imax: 500mA
  Dropout (typical): 50mV @ 150mA, 160mV @ 500mA
  Accuracy: 2% initial
  Thermal shutdown and current limit
  Maximum output voltage is limited by the input voltage and the dropout voltage in the regulator. (Vmax = Vin - dropout)
- DEBUGGER
- (near R209) R210 is required to pull the Q200 gate to a defined value when the U206 is not powered
- ADJUSTABLE OUTPUT AND LIMITATIONS:
  - The DEBUGGER can adjust the output voltage of the regulator between 1.25V and 5.1V to the target.
  - The voltage output is limited by the input (USB), which can vary between 4.40V to 5.25V
  - The level shifters have a minimal voltage level of 1.65V and will limit the minimum operating voltage allowed for the target to still allow communication.
  - The MIC94163 has a minimal volatege level of 1.70V and will limit the minimum voltage delivered to the target.
  - Firmware configuration will limit the voltage range to be within the the target specification.
- MIC5528:
  Vin: 2.5V to 5.5V
  Vout: Fixed 3.3V
  Imax: 500mA
  Dropout: 260mV @ 500mA
- SLEW RATE LIMIT:
  - With C206 = 2200pF, the slew rate of VCC_VBUS is limited to 2 V/ms by the power switch MIC2008.
  CURRENT LIMIT:
  - With R211 = 470ohm, the current through the power switch MIC2008 is limited to 500mA.
- START-UP DELAY::
  With C208 = 0.1uF and R214 = 47kohm, the P-MOS is delaying the turn-on of VCC_DELAYED by 1ms, compared to VBUS.
- Programming connector for factory programming of Debugger.
- "GND"
- (near D200) "PS"
- TP200 and TP201 are MTG Holes in the corners of the PCB close to the DEBUGGER section labelled "GND" on the silkscreen.
- Project Owner:
- PCB Layout Contact:
- PartNumber:
- Project Title
- Variant:
- Sheet Title
- Size
- A3
- SCH #:
- PCB #:
- Rev:
- Date:
- Sheet
- Designed with
- Altium.com <http://go.altium.com/MicrochipLandingPage_Evaluation.html>
- File:

### Library data of the parts
C200 C203 C204 = CAP1208: as C103 on sheet PIC18F57Q84_Curiosity_Nano_Target_MCU; Package: 0402; Revision: 4; Symbol: Capacitor NP; Category: Capacitor; Supplier 1: Murata; Supplier Part Number 1: GRM155R61A225KE95D; Operating Temperature: -55C to +85C; Manufacturer 2: Samsung Electro-Mechanics; Manufacturer Part Number 2: CL05A225KP5NSNC; Supplier 2: Samsung Electro-Mechanics; Supplier Part Number 2: CL05A225KP5NSNC
C201 C202 C207 C208 = CAP1033: as C100 on sheet PIC18F57Q84_Curiosity_Nano_Target_MCU; Package: 0402; Revision: 11; Symbol: Capacitor NP; Operating Temperature: -55C to +125C; Category: Capacitor; Manufacturer 2: Samsung Electro-Mechanics; Manufacturer Part Number 2: CL05B104KO5NNNC; Supplier 1: Digi-Key; Supplier Part Number 1: 399-C0402C104K4RAC7867TR-ND; Supplier 2: Digi-Key; Supplier Part Number 2: 1276-1001-1-ND; Manufacturer 3: Würth Elektronik; Manufacturer Part Number 3: 885012205037; Supplier 3: Digi-Key; Supplier Part Number 3: 732-7532-1-ND; Manufacturer 4: Samsung Electro-Mechanics; Manufacturer Part Number 4: CL05B104KO5NNND; Manufacturer 5: Samsung Electro-Mechanics; Manufacturer Part Number 5: CL05B104KO5NNNO; Manufacturer 6: Yageo; Manufacturer Part Number 6: CC0402KRX7R7BB104; Supplier 4: Mouser; Supplier Part Number 4: 187-CL05B104KO5NNND; Supplier 5: Samsung Electro-Mechanics; Supplier Part Number 5: CL05B104KO5NNNO; Supplier 6: Yageo; Supplier Part Number 6: CC0402KRX7R7BB104
C205 = CAP0543: Manufacturer 1: KEMET; Manufacturer Part Number 1: C0603C475K8PAC7867; Voltage: 10V; Description_: CAP CER 4.7uF 10V 10% X5R SMD 0603; Tolerance: 10%; Type: Ceramic; Populated: Yes; Temperature Coefficient: X5R; Restricted Sourcing: No; Package: 0603; Revision: 6; Symbol: Capacitor NP; Operating Temperature: -55C to +85C; Category: Capacitor; Manufacturer 2: Taiyo Yuden; Manufacturer Part Number 2: LMK107BJ475KA-T; Manufacturer 3: Samsung Electro-Mechanics; Manufacturer Part Number 3: CL10A475KP8NNNC; Supplier 1: Digi-Key; Supplier Part Number 1: 399-C0603C475K8PAC7867CT-ND; Supplier 2: Digi-Key; Supplier Part Number 2: 587-1441-1-ND; Supplier 3: Samsung Electro-Mechanics; Supplier Part Number 3: CL10A475KP8NNNC
C206 = CAP1265: Manufacturer 1: KEMET; Manufacturer Part Number 1: C0402C222J3GACTU; Voltage: 25V; Description_: CAP CER 2200pF 25V 5% C0G SMD 0402; Tolerance: 5%; Type: Ceramic; Populated: YES; Temperature Coefficient: C0G; Restricted Sourcing: No; Package: 0402; Revision: 1; Symbol: Capacitor NP; Operating Temperature: -55C to +125C; Category: Capacitor; Supplier 1: Digi-Key; Supplier Part Number 1: 399-8957-1-ND
C209 = CAP0616: Manufacturer 1: KEMET; Manufacturer Part Number 1: C0402C105K9PACTU; Voltage: 6.3V; Description_: CAP CER 1uF 6.3V 10% X5R SMD 0402; Tolerance: 10%; Type: Ceramic; Populated: Yes; Temperature Coefficient: X5R; Restricted Sourcing: No; Package: 0402; Revision: 5; Symbol: Capacitor NP; Operating Temperature: -55C to +85C; Category: Capacitor; Manufacturer 2: Kemet; Manufacturer Part Number 2: C0402C105K9PAC7867; Supplier 1: Digi-Key; Supplier Part Number 1: 399-4873-1-ND; Supplier 2: Digi-Key; Supplier Part Number 2: 399-C0402C105K9PAC7867TR-ND
D200 = LED1092: LED; Manufacturer 1: Rohm Semiconductor; Value: LED SINGLE SML-P12MTT86R YELLOW-GREEN; Description_: DIO LED YELLOW-GREEN 2.2V 20mA 25mcd Clear SMD 0402; Type: LED Single; Forward Current: 20mA; Power: 54mW; Reverse Current: 10uA; Reverse Voltage: 5V; Populated: YES; Restricted Sourcing: No; Revision: 1; Symbol: LED_green; Package: 0402; Operating Temperature: -40C to +85C; Category: Diode; Supplier 1: Rohm Semiconductor; Supplier Part Number 1: SML-P12MTT86R
J200 = CON2116: as J111 on sheet PIC18F57Q84_Curiosity_Nano_Target_MCU; Revision: 1; Symbol: CON JMPR LINK CLOSED; Category: Connector; Assembly Type: Mechanical
J201 = CON2118: Value: CON JMPR 1x2 PCB TRACE LINK; Description_: CON JUMPER-2.54 1x2 PCB TRACE LINK MANUAL CUT; Populated: DNP; Restricted Sourcing: No; Revision: 1; Symbol: CON JMPR LINK CLOSED; Type: Header 2.54mm; Category: Connector; Assembly Type: Mechanical
J202 = CON2119: Description_: CON TP ARRAY 2x3 1.27mm pitch JTAG; Populated: DNP; Revision: 1; Symbol: TESTPOINT ARRAY 2x3 JTAG; Type: Header 1.27mm; Category: Connector; Assembly Type: SMD; Restricted Sourcing: No
J203 = CON2580: Manufacturer 1: KLS Electronic; Value: USB2.0 Type-C FEMALE; Description_: CON USB2.0 Type-C Female SMD R/A; Voltage: 100V AC; Current: 5A; Populated: YES; Restricted Sourcing: No; Revision: 2; Symbol: CON USB2.0-C RCPT SMD RA KLS KLS1-5409; Type: USB; Category: Connector; Supplier 1: Cabcon A/S; Supplier Part Number 1: L-KLS1-5409-R; Operating Temperature: -30C to +85C; Assembly Type: SMD
Q200 = TRA1340: Transistor MOS; Manufacturer 1: Diodes Incorporated; Manufacturer Part Number 1: DMN65D8LFB-7; Description_: TRANS FET N-CH DMN65D8LFB-7B 260mA 60V 430mW X1_DFN1006-3; Type: FET; Current: 260mA; Drain to Source Voltage: 60V; Power: 430mW; Populated: YES; Restricted Sourcing: No; Revision: 3; Symbol: Transistor MOS-N GSD; Package: X1-DFN1006-3; Category: Transistor; Voltage: 60V; Supplier 1: Digi-Key; Supplier Part Number 1: DMN65D8LFB-7DITR-ND; Manufacturer 2: Diodes Incorporated; Manufacturer Part Number 2: DMN65D8LFB-7B; Supplier 2: Digi-Key; Supplier Part Number 2: DMN65D8LFB-7BDICT-ND
Q201 = TRA1611: Transistor MOS; Manufacturer 1: Texas Instruments; Description_: TRANS FET P-CH CSD25501F3 -20V -3.6A 0.076R LGA; Type: FET; Current: -3.6A; Drain to Source Voltage: -20V; Populated: YES; Restricted Sourcing: No; Revision: 1; Symbol: Transistor MOS-P GSD; Package: LGA; Operating Temperature: -55C to +150C; Category: Transistor; Gate to Source Voltage: -20V; Voltage: -20V; Manufacturer Part Number 1: CSD25501F3; Manufacturer 2: Texas Instruments; Manufacturer Part Number 2: CSD25501F3T; Supplier 1: Digi-Key; Supplier Part Number 1: 296-51017-2-ND; Supplier 2: Digi-Key; Supplier Part Number 2: 296-47556-2-ND
R200-R205 R207 R210 R213 R214 = RES2662: as R100 on sheet PIC18F57Q84_Curiosity_Nano_Target_MCU; Package: 0402; Revision: 3; Symbol: Resistor; Category: Resistor; Type: RES SMD; Composition: TKF; Supplier 1: Digi-Key; Supplier Part Number 1: 311-47.0KLRCT-ND
R206 = RES2661: Manufacturer 1: Yageo; Manufacturer Part Number 1: RC0402FR-0727KL; Tolerance: 1%; Description_: RES TKF 27k 1% 1/16W SMD 0402; Populated: YES; Voltage: 50V; Restricted Sourcing: No; Package: 0402; Revision: 3; Symbol: Resistor; Category: Resistor; Type: RES SMD; Composition: TKF; Supplier 1: Digi-Key; Supplier Part Number 1: 311-27.0KLRCT-ND
R208 = RES1994: Manufacturer 1: Yageo; Manufacturer Part Number 1: AC0402FR-0733KL; Tolerance: 1%; Description_: RES TKF 33k 1% 1/16W SMD 0402; Power: 1/16W; Populated: YES; Temperature Coefficient: 100ppm/C; Restricted Sourcing: No; Package: 0402; Revision: 2; Symbol: Resistor; Operating Temperature: -55C to +155C; Category: Resistor; Type: RES SMD; Composition: TKF; Supplier 1: Digi-Key; Supplier Part Number 1: YAG3477CT-ND
R209 R212 R215 R218 = RES1022: as R103 on sheet PIC18F57Q84_Curiosity_Nano_Target_MCU; Package: 0402; Revision: 3; Symbol: Resistor; Operating Temperature: -55C to +155C; Category: Resistor; Type: RES SMD; Composition: TKF; Supplier 1: Digi-Key; Supplier Part Number 1: P1.00KLTR-ND
R211 = RSMT1163: Manufacturer 1: Yageo; Manufacturer Part Number 1: RC0402FR-07470RL; Tolerance: 1%; Description_: RES TKF 470R 1% 1/16W MF 0402; Populated: YES; Restricted Sourcing: No; Package: 0402; Revision: 2; Symbol: resistor; Category: Resistor; Type: RES SMD; Supplier 1: Digi-Key; Supplier Part Number 1: 311-470LRCT-ND
R216 R217 = RES1655: Manufacturer 1: Panasonic Electronic Components; Manufacturer Part Number 1: ERJ-2RKF5101X; Tolerance: 1%; Description_: RES TKF 5.1k 1% 1/10W SMD 0402; Temperature Coefficient: 100ppm/C; Power: 1/10W; Populated: YES; Package: 0402; Revision: 1; Symbol: Resistor; Operating Temperature: -55C to +155C; Category: Resistor; Type: RES SMD; Composition: TKF; Supplier 1: Digi-Key; Supplier Part Number 1: P5.10KLCT-ND
TP200 TP201 = CON2131: Test Point; Value: TP TH D3.6H2.7; Description_: CON TP PAD PCB TH D3.6H2.7; Populated: Yes; Revision: 1; Symbol: Test Point No Bom; Type: Test Point No BOM; Category: Connector; Assembly Type: TH; Restricted Sourcing: No
TP202 TP203 = CON2120: Test Point; Value: TP SMD D0.8; Description_: CON TP PAD PCB SMD D0.8; Populated: DNP; Revision: 1; Symbol: Test Point No BOM; Type: Test Point No BOM; Category: Connector; Assembly Type: SMD; Restricted Sourcing: No
U200 = MIC7389: LDO Regulator; Manufacturer 1: Microchip Technology; Description_: MCHP ANALOG LDO ADJ 500mA MIC5353YMT-TR MLF-6; Populated: YES; Restricted Sourcing: No; Symbol: MIC53XX ADJ MLF-6; Type: LDO; Revision: 2; Category: MCHP-Analog; Manufacturer Part Number 1: MIC5353YMT-TR; Supplier 1: Digi-Key; Supplier Part Number 1: 576-3681-1-ND; Operating Temperature: -40C to +125C
U201 = MIC8744: Manufacturer 1: Microchip Technology; Manufacturer Part Number 1: MIC94163YCS-TR; Description_: IC LOAD SWITCH HI SIDE 3A 6WLCSP; Populated: YES; Restricted Sourcing: No; Symbol: MIC94163_1.5MM_1MM; Type: Power Switch; Revision: 1; Category: MCHP-Analog; Supplier 1: Digi-Key; Supplier Part Number 1: 576-4454-2-ND; Operating Temperature: -40C to +125C
U202 = MIC9604: Manufacturer 1: Microchip Technology; Description_: MCHP ANALOG POWER SWITCH 5.5V 2.1A MIC2008YML-TR VDFN-6; Populated: YES; Restricted Sourcing: No; Symbol: MIC2008YML-TR VDFN-6; Type: Power Switch; Revision: 1; Category: MCHP-Analog; Manufacturer Part Number 1: MIC2008YML-TR; Supplier 1: Digi-Key; Supplier Part Number 1: 576-2591-2-ND; Operating Temperature: -40C to +85C; Supplier 2: Microchip Technology; Supplier Part Number 2: MIC2008YML-TR
U203 = MIC6905: Manufacturer 1: Microchip Technology; Value: MIC5528 3V3; Description_: MCHP ANALOG LDO 3.3V MIC5528-3.3YMT-TR 6-TDFN; Populated: YES; Symbol: MIC5528MT DFN-6; Type: LDO; Revision: 3; Category: MCHP-Analog; Supplier 1: Digi-Key; Supplier Part Number 1: 576-4766-1-ND; Operating Temperature: -40C to +125C; Manufacturer 2: Microchip Technology; Manufacturer Part Number 2: MIC5528-3.3YMT-T5; Supplier 2: Microchip Technology; Supplier Part Number 2: MIC5528-3.3YMT-T5
U204 U205 U207-U209 = IC1665: Manufacturer 1: Diodes Incorporated; Description_: IC VOLTAGE TRANSLATOR BI-DIR 1 CIRCUIT 74LVC1T45FW4-7 X2-DFN1010-6; Populated: YES; Restricted Sourcing: No; Revision: 2; Symbol: 74LVC(H)1T45 SOT-23-6_SC-70-6_SOT-6_SOT-363_DSBGA; Type: Translator; Category: IC; Manufacturer Part Number 1: 74LVC1T45FW4-7; Supplier 1: Digi-Key; Supplier Part Number 1: 74LVC1T45FW4-7DICT-ND
U206 = MIC8641: Manufacturer 1: Microchip Technology; Manufacturer Part Number 1: ATSAMD21E18A-MUT; Description_: MCHP MCU 32-BIT 48MHz 256Kb 32Kb ATSAMD21E18A-MUT QFN-32; Populated: YES; Restricted Sourcing: No; Symbol: SAMD21E QFN-32; Type: 32-Bit MPU; Revision: 3; Category: MCHP-Microcontroller; Supplier 1: Digi-Key; Supplier Part Number 1: ATSAMD21E18A-MUTCT-ND; Operating Temperature: -40C to +85C

## Sheet PIC18F57Q84_Curiosity_Nano_Revision_History.SchDoc
size A3; SheetTitle: Revision History; CompanyName: Microchip Technology Inc.; Organization: Microchip Technology; Address1: 2355 West Chandler Blvd.; Address2: Chandler, AZ  85224; Address4: USA; SheetNumber: 4; SheetTotal: 4; Time: Time
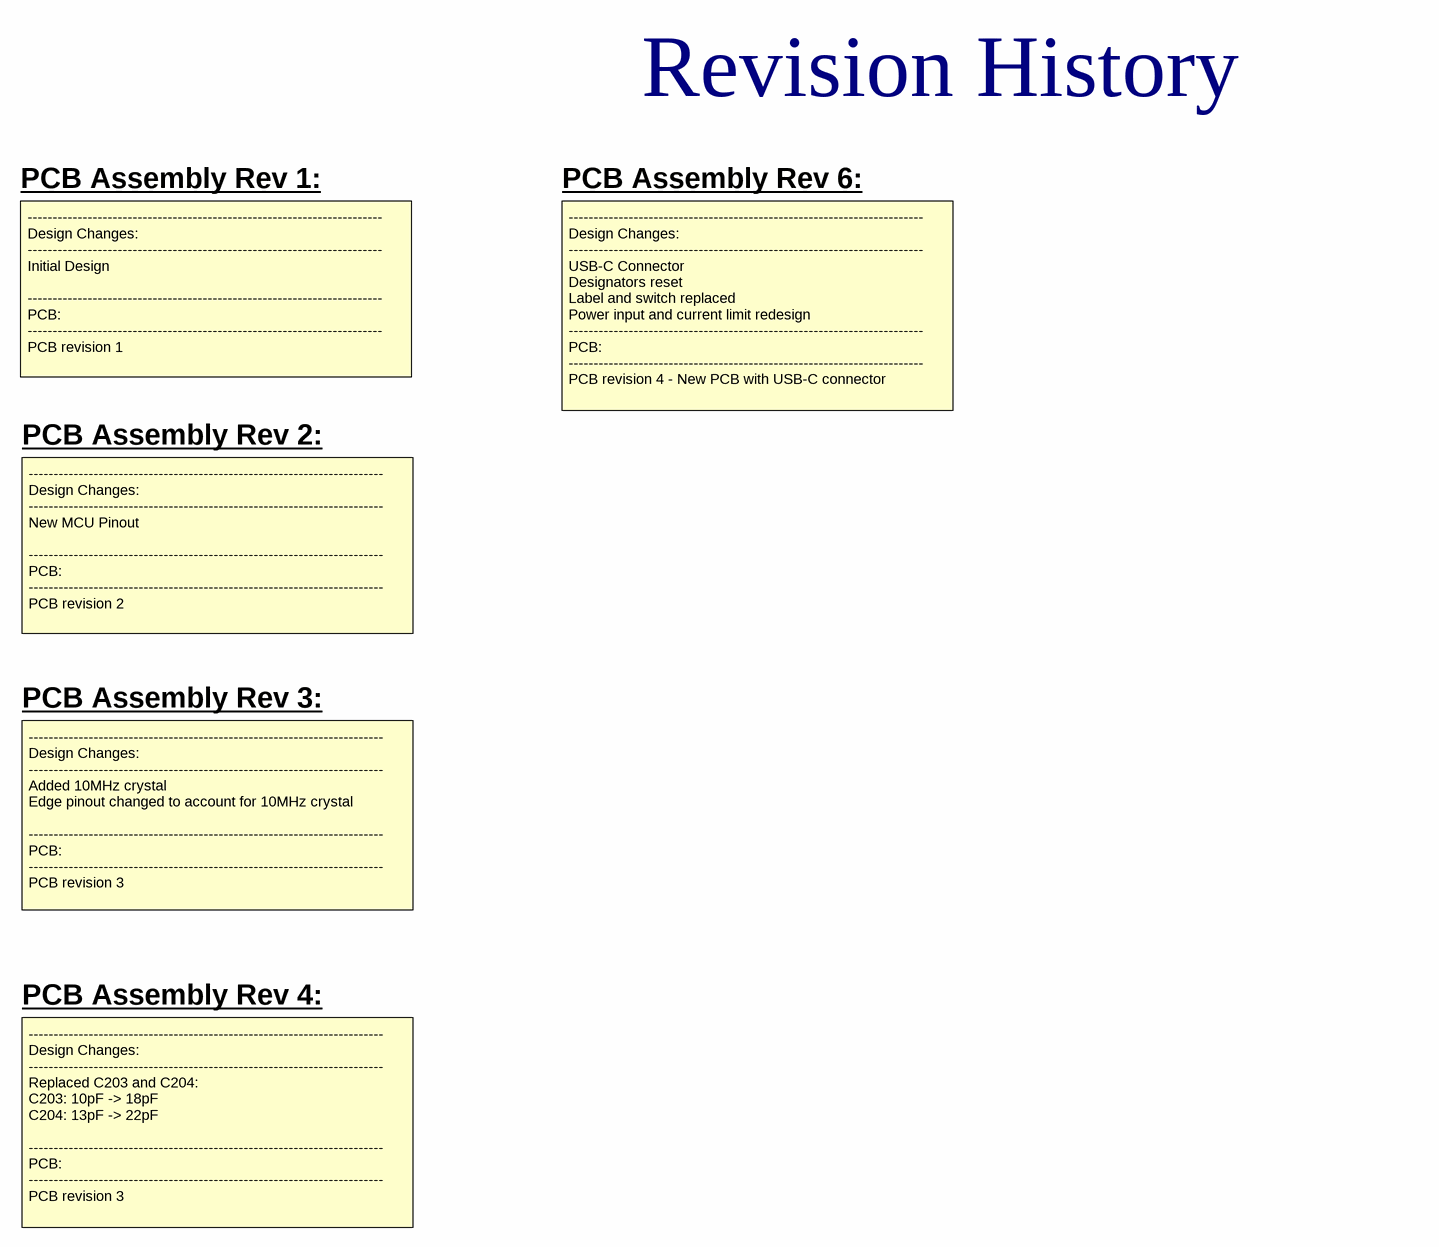
[diagram p3: PIC18F57Q84_Curiosity_Nano_Revision_History.SchDoc]

### Notes on the sheet
- Revision History
- PCB Assembly Rev 1:
- PCB Assembly Rev 6:
- -----------------------------------------------------------------------
  Design Changes:
  -----------------------------------------------------------------------
  Initial Design
  -----------------------------------------------------------------------
  PCB:
  -----------------------------------------------------------------------
  PCB revision 1
- PCB Assembly Rev 2:
- -----------------------------------------------------------------------
  Design Changes:
  -----------------------------------------------------------------------
  USB-C Connector
  Designators reset
  Label and switch replaced
  Power input and current limit redesign
  -----------------------------------------------------------------------
  PCB:
  -----------------------------------------------------------------------
  PCB revision 4 - New PCB with USB-C connector
- -----------------------------------------------------------------------
  Design Changes:
  -----------------------------------------------------------------------
  New MCU Pinout
  -----------------------------------------------------------------------
  PCB:
  -----------------------------------------------------------------------
  PCB revision 2
- PCB Assembly Rev 3:
- -----------------------------------------------------------------------
  Design Changes:
  -----------------------------------------------------------------------
  Added 10MHz crystal
  Edge pinout changed to account for 10MHz crystal
  -----------------------------------------------------------------------
  PCB:
  -----------------------------------------------------------------------
  PCB revision 3
- PCB Assembly Rev 4:
- -----------------------------------------------------------------------
  Design Changes:
  -----------------------------------------------------------------------
  Replaced C203 and C204:
  C203: 10pF -> 18pF
  C204: 13pF -> 22pF
  -----------------------------------------------------------------------
  PCB:
  -----------------------------------------------------------------------
  PCB revision 3
- Project Owner:
- PCB Layout Contact:
- PartNumber:
- Project Title
- Variant:
- Sheet Title
- Size
- A3
- SCH #:
- PCB #:
- Rev:
- Date:
- Sheet
- Designed with
- Altium.com <http://go.altium.com/MicrochipLandingPage_Evaluation.html>
- File:

## Nets that join several sheets
GND: PIC18F57Q84_Curiosity_Nano_Target_MCU (20 pins), PIC18F57Q84_Curiosity_Nano_Debugger (46 pins)
VCC_EDGE: PIC18F57Q84_Curiosity_Nano_Target_MCU (C103.2 J100.51), PIC18F57Q84_Curiosity_Nano_Debugger (J200.2 J201.1)
VCC_TARGET: PIC18F57Q84_Curiosity_Nano_Target_MCU (6 pins), PIC18F57Q84_Curiosity_Nano_Debugger (J201.2)
VCC_VBUS: PIC18F57Q84_Curiosity_Nano_Target_MCU (J100.56), PIC18F57Q84_Curiosity_Nano_Debugger (6 pins)
CDC_RX: PIC18F57Q84_Curiosity_Nano_Target_MCU (J100.3 J101.1), PIC18F57Q84_Curiosity_Nano_Debugger (U208.4)
CDC_TX: PIC18F57Q84_Curiosity_Nano_Target_MCU (J100.4 J103.1), PIC18F57Q84_Curiosity_Nano_Debugger (U209.4)
DBG0: PIC18F57Q84_Curiosity_Nano_Target_MCU (J100.53 J104.1 R100.1), PIC18F57Q84_Curiosity_Nano_Debugger (U207.4)
DBG1: PIC18F57Q84_Curiosity_Nano_Target_MCU (J100.5 J105.1 R101.1), PIC18F57Q84_Curiosity_Nano_Debugger (U205.4)
DBG2: PIC18F57Q84_Curiosity_Nano_Target_MCU (J100.6 J106.1), PIC18F57Q84_Curiosity_Nano_Debugger (U204.4)
DBG3: PIC18F57Q84_Curiosity_Nano_Target_MCU (J100.54 J102.1), PIC18F57Q84_Curiosity_Nano_Debugger (R209.2)
ID_SYS: PIC18F57Q84_Curiosity_Nano_Target_MCU (J100.2), PIC18F57Q84_Curiosity_Nano_Debugger (R218.1 U206.22)
~{VOFF}: PIC18F57Q84_Curiosity_Nano_Target_MCU (J100.55), PIC18F57Q84_Curiosity_Nano_Debugger (U206.20)

## Assembly variants
Default Assembly: not fitted C203 C204 Y200